# Altium schematic sheet BME_280_Sheet1.SchDoc
size A4; SheetNumber: 3; SheetTotal: 11
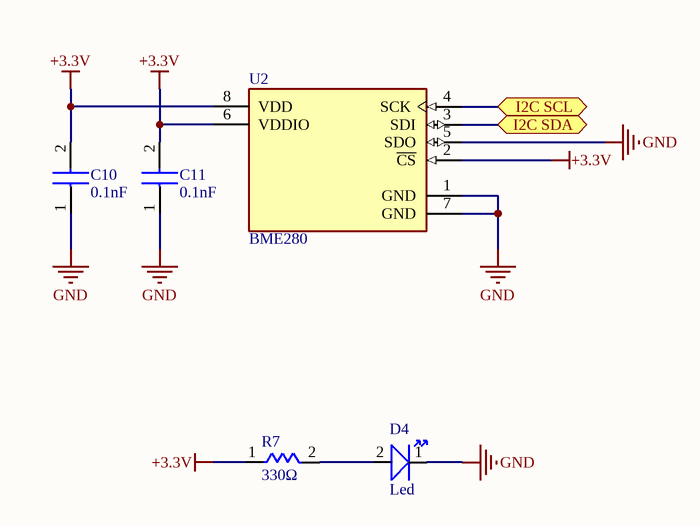
[diagram p0: BME_280_Sheet1.SchDoc]

## Parts
C10  0.1nF  [CAP - 0603]
C11  0.1nF  [CAP - 0603]
D4  Led  [LED - 0603]
R7  330Ω  [RES - 0603]
U2  BME280  [BME280 - FP-BME280-MFG]

## Ports
I2C SCL (bidir), I2C SDA (bidir)

## Nets
+3.3V: C10.2 C11.2 R7.1 U2.2(~{CS}) U2.6(VDDIO) U2.8(VDD)
GND: C10.1 C11.1 D4.1 U2.1(GND) U2.5(SDO) U2.7(GND)
I2C SCL: U2.4(SCK) ; port I2C SCL
I2C SDA: U2.3(SDI) ; port I2C SDA
NetD4_2: D4.2 R7.2

## Library data of the parts
C10 C11 = CAP: Capacitor; ComponentLink1Description: Satın Alma Linki; ComponentLink1URL: https://ozdisan.com/pasif-komponentler/kondansatorler/smt-smd-ve-mlcc-kondansatorler/CL10B472KB8NNNC; ComponentLink2Description: Satın Alma Linki; ComponentLink2URL: https://ozdisan.com/pasif-komponentler/kondansatorler/smt-smd-ve-mlcc-kondansatorler/CL10C200JB8NNNC; ComponentLink3Description: Satın Alma Linki; ComponentLink3URL: https://ozdisan.com/pasif-komponentler/kondansatorler/smt-smd-ve-mlcc-kondansatorler/CL10B104KB8NNNC; ComponentLink4Description: Datasheet; ComponentLink4URL: https://cdn.ozdisan.com/ETicaret_Dosya/448212_5798276.PDF; ComponentLink5Description: Satın Alma Linki; ComponentLink5URL: https://ozdisan.com/pasif-komponentler/kondansatorler/smt-smd-ve-mlcc-kondansatorler/CL10C101JB8NNNC
D4 = Led: HL-PST-1608U51GC - LED SMD 0603 GREEN 500mcd 120° WATER CLEAR; ComponentLink1Description: Satın Alma Linki; ComponentLink1URL: https://ozdisan.com/Product/Detail/471660/HL-PST-1608U51GC; ComponentLink2Description: Datasheet; ComponentLink2URL: https://cdn.ozdisan.com/ETicaret_Dosya/471660_7204356.pdf
R7 = Res: SMD Res; ComponentLink1Description: Datasheet; ComponentLink1URL: https://cdn.ozdisan.com/ETicaret_Dosya/570122_9878629.pdf; ComponentLink2Description: Satın Alma Linki; ComponentLink2URL: https://www.ozdisan.com/pasif-komponentler/direncler/smt-smd-direncler/TC0325B3301T5C; ComponentLink3Description: Satın Alma Linki; ComponentLink3URL: https://ozdisan.com/pasif-komponentler/direncler/smt-smd-ve-cip-direncler/0603SAF4701T5E; ComponentLink4Description: Satın Alma Linki; ComponentLink4URL: https://ozdisan.com/pasif-komponentler/direncler/smt-smd-ve-cip-direncler/0805S8F604JT5E; ComponentLink5Description: Satın Alma Linki; ComponentLink5URL: https://ozdisan.com/pasif-komponentler/direncler/smt-smd-ve-cip-direncler/0603SAF1022T5E; ComponentLink6Description: Satın Alma Linki; ComponentLink6URL: https://www.ozdisan.com/pasif-komponentler/direncler/smt-smd-direncler/CQ03SAF0000T5E
U2 = BME 280- CMP-2000-05073-3: SENSOR PRESSURE HUMIDITY TEMP; Sensor Type: Temperature; Accuracy: 3%; Response Time: 1s; Output Type: SPI; Min Operating Temperature: -40°C; Max Operating Temperature: 85°C; Case/Package: LGA; Packaging: Cut Tape; Mount: Surface Mount; Lead Free: Lead Free; Number of Pins: 8; ComponentLink1Description: Satın Alma Linki; ComponentLink1URL: https://ozdisan.com/optolar-ve-sensorler/sensorler/nem-sensorleri/BME280; ComponentLink2Description: Datasheet; ComponentLink2URL: https://cdn.ozdisan.com/ETicaret_Dosya/611017_160241.pdf